# Altium project mikro.PrjPcb
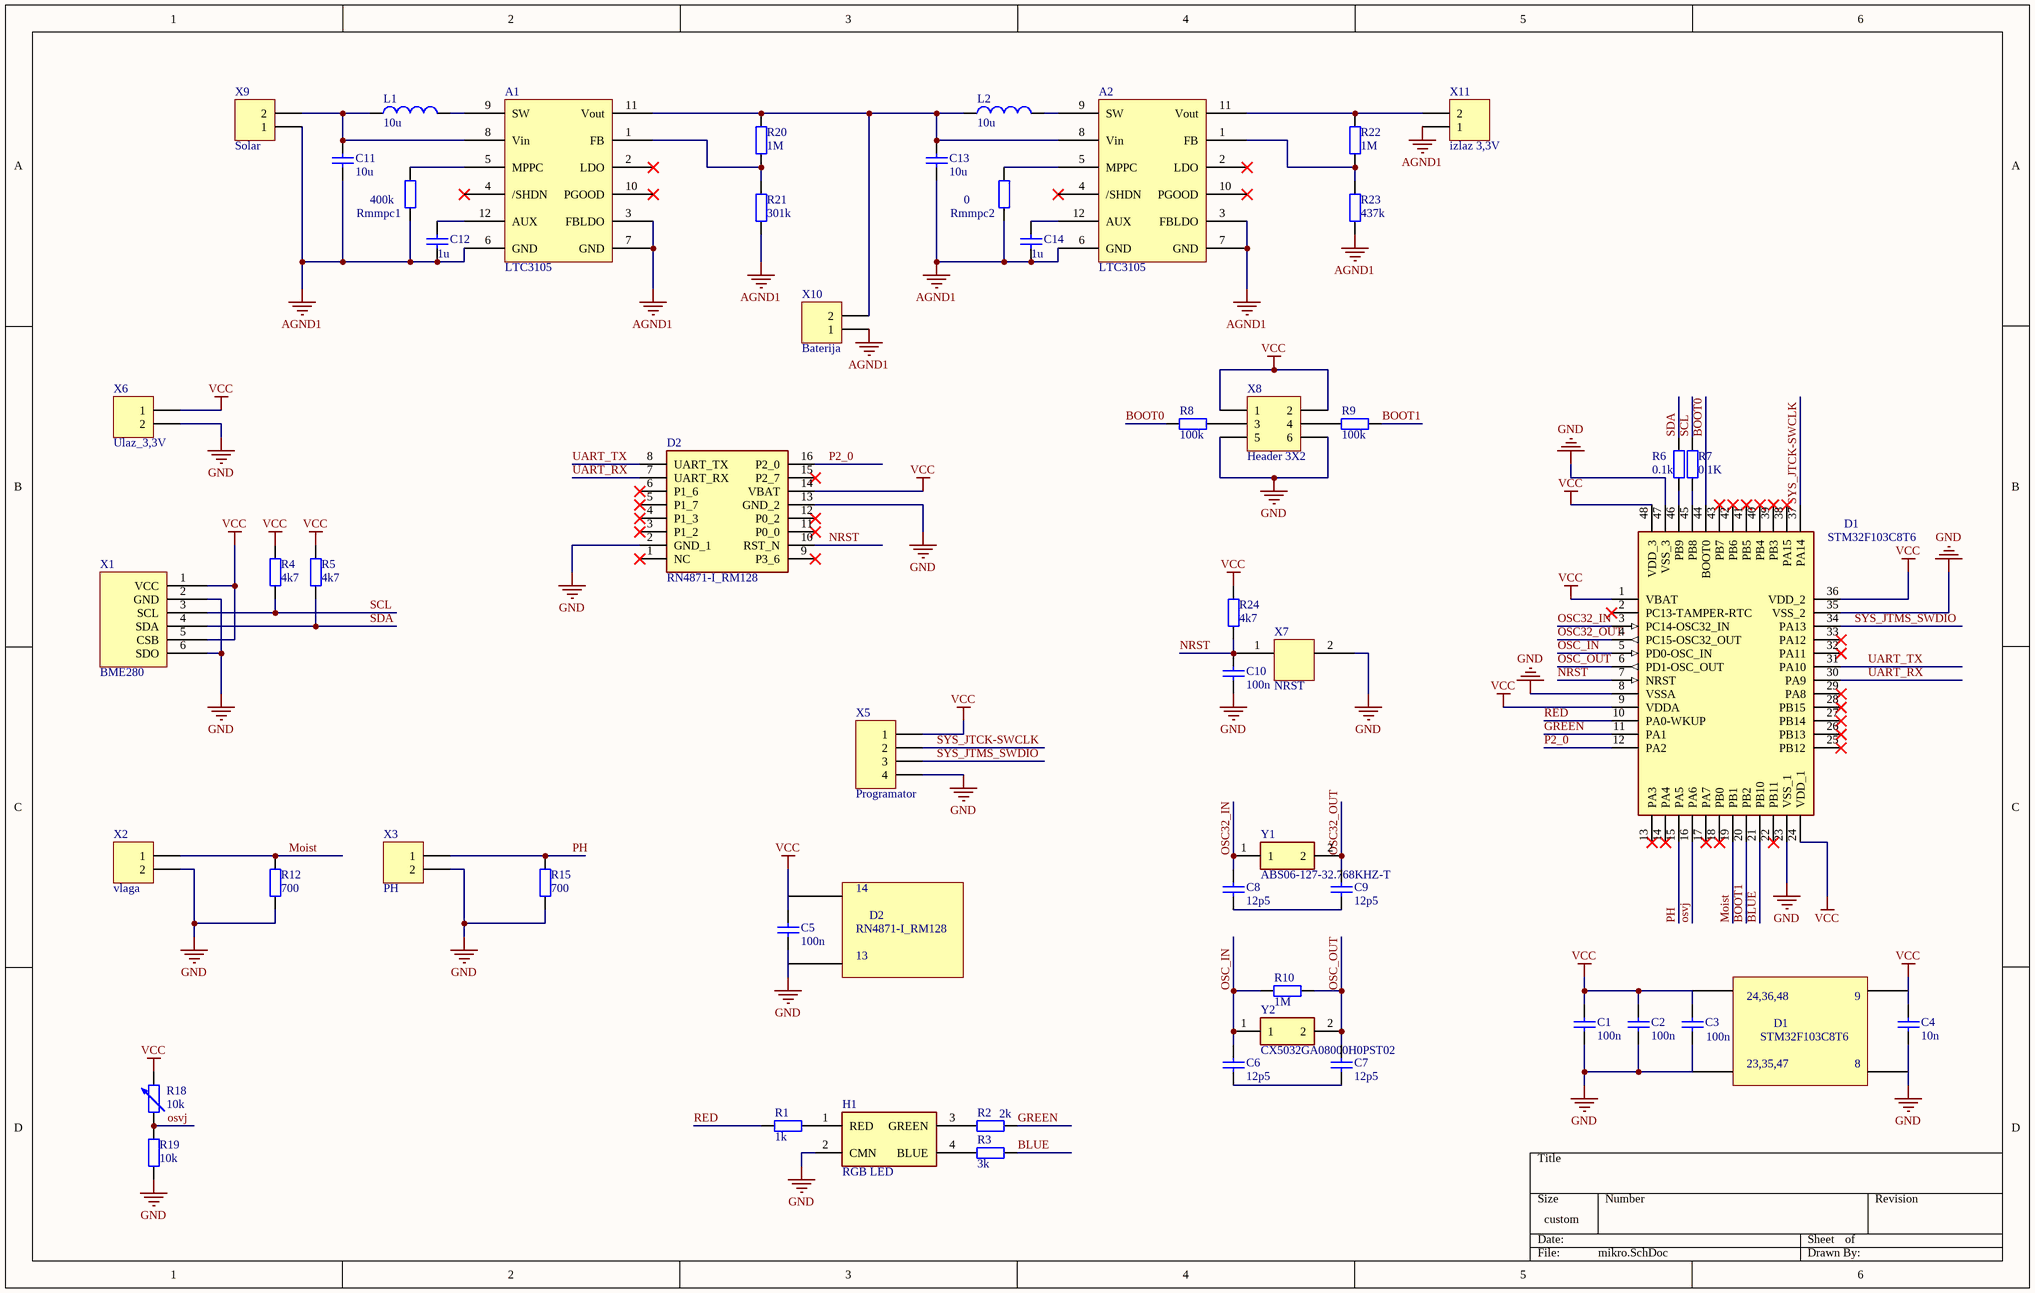
[diagram p0: mikro.SchDoc]
1 sheet, 54 parts. Net scope: global (net labels, ports and power ports of the same name join across sheets).
Board file: Schroom_plocica.PcbDoc

## Sheet mikro.SchDoc
size 381 x 241 mm

### Parts
A1  LTC3105  [SOP65P490X110-12N]
A2  LTC3105  [SOP65P490X110-12N]
C1  100n  [6-0805_N]
C2  100n  [6-0805_N]
C3  100n  [6-0805_N]
C4  10n  [6-0805_N]
C5  100n  [6-0805_N]
C6  12p5  [6-0805_N]
C7  12p5  [6-0805_N]
C8  12p5  [6-0805_N]
C9  12p5  [6-0805_N]
C10  100n  [6-0805_N]
C11  10u  [6-0805_N]
C12  1u  [6-0805_N]
C13  10u  [6-0805_N]
C14  1u  [6-0805_N]
D1  STM32F103C8T6  [QFP50P900X900X160-48N]
D2  RN4871-I_RM128  [RN4871]
H1  RGB LED  [HV5RGB25]
L1  10u  [6-0805_N]
L2  10u  [6-0805_N]
R1  1k  [6-0805_N]
R2  2k  [6-0805_N]
R3  3k  [6-0805_N]
R4  4k7  [6-0805_N]
R5  4k7  [6-0805_N]
R6  0.1k  [6-0805_N]
R7  0.1K  [6-0805_N]
R8  100k  [6-0805_N]
R9  100k  [6-0805_N]
R10  1M  [6-0805_N]
R12  700  [6-0805_N]
R15  700  [6-0805_N]
R18  10k  [HDR1X2]
R19  10k  [6-0805_N]
R20  1M  [6-0805_N]
R21  301k  [6-0805_N]
R22  1M  [6-0805_N]
R23  437k  [6-0805_N]
R24  4k7  [6-0805_N]
Rmmpc1  400k  [6-0805_N]
Rmmpc2  0  [6-0805_N]
X1  BME280  [HDR1X6]
X2  vlaga  [HDR1X2]
X3  PH  [HDR1X2]
X5  Programator  [HDR1X4]
X6  Ulaz_3,3V  [HDR1X2]
X7  NRST
X8  Header 3X2  [HDR2X3]
X9  Solar  [HDR1X2]
X10  Baterija  [HDR1X2]
X11  izlaz 3,3V  [HDR1X2]
Y1  ABS06-127-32.768KHZ-T  [ABS0612732768KHZT]
Y2  CX5032GA08000H0PST02  [CX5032GA08000H0PST02]

### Nets
AGND1: A1.3(FBLDO) A1.6(GND) A1.7(GND) A2.3(FBLDO) A2.6(GND) A2.7(GND) C11.1 C12.1 C13.1 C14.1 R21.2 R23.2 Rmmpc1.1 Rmmpc2.1 X9.1 X10.1 X11.1
GND: C1.1 C2.1 C3.1 C4.1 C5.1 C10.1 D1.8(VSSA) D1.23(VSS_1) D1.35(VSS_2) D1.47(VSS_3) D2.2(GND_1) D2.13(GND_2) H1.2(CMN) R12.2 R15.2 R19.1 X1.2(GND) X1.6(SDO) X2.2 X3.2 X5.4 X6.2 X7.2 X8.5 X8.6
VCC: C1.2 C2.2 C3.2 C4.2 C5.2 D1.1(VBAT) D1.9(VDDA) D1.24(VDD_1) D1.36(VDD_2) D1.48(VDD_3) D2.14(VBAT) R4.2 R5.2 R18.2 R24.1 X1.1(VCC) X1.5(CSB) X5.1 X6.1 X8.1 X8.2
BLUE: D1.21(PB10) R3.2
BOOT0: D1.44(BOOT0) R8.2
BOOT1: D1.20(PB2) R9.1
GREEN: D1.11(PA1) R2.2
Moist: D1.19(PB1) R12.1 X2.1
NRST: C10.2 D1.7(NRST) D2.10(RST_N) R24.2 X7.1
OSC32_IN: C8.2 D1.3(PC14-OSC32_IN) Y1.1
OSC32_OUT: C9.2 D1.4(PC15-OSC32_OUT) Y1.2
OSC_IN: C6.2 D1.5(PD0-OSC_IN) R10.1 Y2.1
OSC_OUT: C7.2 D1.6(PD1-OSC_OUT) R10.2 Y2.2
osvj: D1.16(PA6) R18.1 R19.2
P2_0: D1.12(PA2) D2.16(P2_0)
PH: D1.15(PA5) R15.1 X3.1
RED: D1.10(PA0-WKUP) R1.1
SCL: R4.1 R7.2 X1.3(SCL)
SDA: R5.1 R6.2 X1.4(SDA)
SYS_JTCK-SWCLK: D1.37(PA14) X5.2
SYS_JTMS_SWDIO: D1.34(PA13) X5.3
UART_RX: D1.30(PA9) D2.7(UART_RX)
UART_TX: D1.31(PA10) D2.8(UART_TX)
NetA1_1: A1.1(FB) R20.1 R21.1
NetA1_5: A1.5(MPPC) Rmmpc1.2
NetA1_8: A1.8(Vin) C11.2 L1.1 X9.2
NetA1_9: A1.9(SW) L1.2
NetA1_11: A1.11(Vout) A2.8(Vin) C13.2 L2.1 R20.2 X10.2
NetA1_12: A1.12(AUX) C12.2
NetA2_1: A2.1(FB) R22.1 R23.1
NetA2_5: A2.5(MPPC) Rmmpc2.2
NetA2_9: A2.9(SW) L2.2
NetA2_11: A2.11(Vout) R22.2 X11.2
NetA2_12: A2.12(AUX) C14.2
NetC6_1: C6.1 C7.1
NetC8_1: C8.1 C9.1
NetD1_45: D1.45(PB8) R7.1
NetD1_46: D1.46(PB9) R6.1
NetH1_1: H1.1(RED) R1.2
NetH1_3: H1.3(GREEN) R2.1
NetH1_4: H1.4(BLUE) R3.1
NetR8_1: R8.1 X8.3
NetR9_2: R9.2 X8.4

Not connected (* = marked no-connect by the designer): A1 2(LDO)* 4(/SHDN)* 10(PGOOD)*; A2 2(LDO)* 4(/SHDN)* 10(PGOOD)*; D1 2(PC13-TAMPER-RTC)* 13(PA3)* 14(PA4)* 17(PA7)* 18(PB0)* 22(PB11)* 25(PB12)* 26(PB13)* 27(PB14)* 28(PB15)* 29(PA8)* 32(PA11)* 33(PA12)* 38(PA15)* 39(PB3)* 40(PB4)* 41(PB5)* 42(PB6)* 43(PB7)*; D2 1(NC)* 3(P1_2)* 4(P1_3)* 5(P1_7)* 6(P1_6)* 9(P3_6)* 11(P0_0)* 12(P0_2)* 15(P2_7)*

### Notes on the sheet
- 14
- RN4871-I_RM128
- 13
- D2
- 24,36,48
- STM32F103C8T6
- D1
- (near C4) 9
- 23,35,47
- 8

### Library data of the parts
C1-C14 = Cap: Capacitor; Value: 100pF; Published: 8-Jun-2000; LatestRevisionDate: 17-Jul-2002; LatestRevisionNote: Re-released for DXP Platform.; PackageReference: RAD-0.3; Publisher: Altium Limited; PackageDescription: Radial Cap, Thru-Hole; 2 Leads; 0.3 in Pin Spacing
D1 = STM32F103C8T6: Integrated Circuit; Manufacturer_Name: STMicroelectronics; Allied_Number: 70390993; Datasheet Link: http://www.st.com/st-web-ui/static/active/en/resource/technical/document/datasheet/CD00161566.pdf; Height: 1.6mm; Manufacturer_Part_Number: STM32F103C8T6; Mouser Part Number: 511-STM32F103C8T6; Mouser Price/Stock: https://www.mouser.com/Search/Refine.aspx?Keyword=511-STM32F103C8T6; RS Part Number: 0402279P; RS Price/Stock: http://uk.rs-online.com/web/p/products/0402279P; Allied Price/Stock: http://www.alliedelec.com/stmicroelectronics-stm32f103c8t6/70390993/
D2 = RN4871-I_RM128: Integrated Circuit; Manufacturer_Name: Microchip; Manufacturer_Part_Number: RN4871-I/RM128; Datasheet Link: http://ww1.microchip.com/downloads/en/DeviceDoc/50002489C.pdf; Mouser Part Number: 579-RN4871-I/RM128; Mouser Price/Stock: https://www.mouser.com/Search/Refine.aspx?Keyword=579-RN4871-I%2FRM128; RS Part Number: 1372666P; RS Price/Stock: http://uk.rs-online.com/web/p/products/1372666P
H1 = APTF1616LSEEZGKQBKC: LED; Manufacturer_Name: Kingbright; Allied_Number: 70820333; Datasheet Link: https://componentsearchengine.com/Datasheets/1/APTF1616LSEEZGKQBKC.pdf; Manufacturer_Part_Number: APTF1616LSEEZGKQBKC; Mouser Part Number: 604-APTF1616LSEEZGKQ; Mouser Price/Stock: https://www.mouser.com/Search/Refine.aspx?Keyword=604-APTF1616LSEEZGKQ; Allied Price/Stock: https://www.alliedelec.com/kingbright-aptf1616lseezgkqbkc/70820333/
L1 L2 = Inductor: Code_IEC: 1005; Value: 10mH; Published: 8-Jun-2000; LatestRevisionDate: 29-May-2009; LatestRevisionNote: IPC-7351 Footprint Added.; PackageReference: 0402-A; Publisher: Altium Limited; PackageDescription: Chip Inductor; Code_JEITA: 0402
R1 = Res2: Resistor; Published: 8-Jun-2000; LatestRevisionDate: 17-Jul-2002; LatestRevisionNote: Re-released for DXP Platform.; PackageReference: AXIAL-0.4; Publisher: Altium Limited; PackageDescription: Axial Device, Thru-Hole; 2 Leads; 0.4 in Pin Spacing; Value: 1K
R2-R10 R12 R15 R19-R24 Rmmpc1 Rmmpc2 = Res2: Resistor; Value: 1K; Published: 8-Jun-2000; LatestRevisionDate: 17-Jul-2002; LatestRevisionNote: Re-released for DXP Platform.; PackageReference: AXIAL-0.4; Publisher: Altium Limited; PackageDescription: Axial Device, Thru-Hole; 2 Leads; 0.4 in Pin Spacing
R18 = Res Adj2: Variable Resistor; Value: 1K; Set Position: 0.5; Published: 8-Jun-2000; LatestRevisionDate: 17-Jul-2002; LatestRevisionNote: Re-released for DXP Platform.; PackageReference: AXIAL-0.6; Publisher: Altium Limited; PackageDescription: Axial Device, Thru-Hole; 2 Leads; 0.6 in Pin Spacing
X2 X3 X6 X9-X11 = Header 2: Header, 2-Pin; LatestRevisionDate: 17-Jul-2002; LatestRevisionNote: Re-released for DXP Platform.; Publisher: Altium Limited
X5 = Header 4: Header, 4-Pin; LatestRevisionDate: 17-Jul-2002; LatestRevisionNote: Re-released for DXP Platform.; Publisher: Altium Limited
X7 = jumper
X8 = Header 3X2: Header, 3-Pin, Dual row; LatestRevisionDate: 17-Jul-2002; LatestRevisionNote: Re-released for DXP Platform.; Publisher: Altium Limited
Y1 = ABS06-127-32.768KHZ-T: Crystal or Oscillator; Manufacturer_Name: ABRACON; Datasheet Link: https://abracon.com/datasheets/ABS06-127-32.768kHz-T.pdf; Height: 0.6mm; Manufacturer_Part_Number: ABS06-127-32.768KHZ-T; Mouser Part Number: 815-ABS0612732.768KT; Mouser Price/Stock: https://www.mouser.com/Search/Refine.aspx?Keyword=815-ABS0612732.768KT; RS Part Number: 1753472P; RS Price/Stock: http://uk.rs-online.com/web/p/products/1753472P
Y2 = CX5032GA08000H0PST02: Crystal or Oscillator; Manufacturer_Name: Kyocera Electronic Components; Datasheet Link: https://media.digikey.com/pdf/Data%20Sheets/AVX%20PDFs/CX5032GA08000H0PST02_Spec.pdf; Height: 1mm; Manufacturer_Part_Number: CX5032GA08000H0PST02; Mouser Part Number: 581-CX5032GA08H0PST; Mouser Price/Stock: https://www.mouser.com/Search/Refine.aspx?Keyword=581-CX5032GA08H0PST